# Altium schematic sheet main.SchDoc
size A4
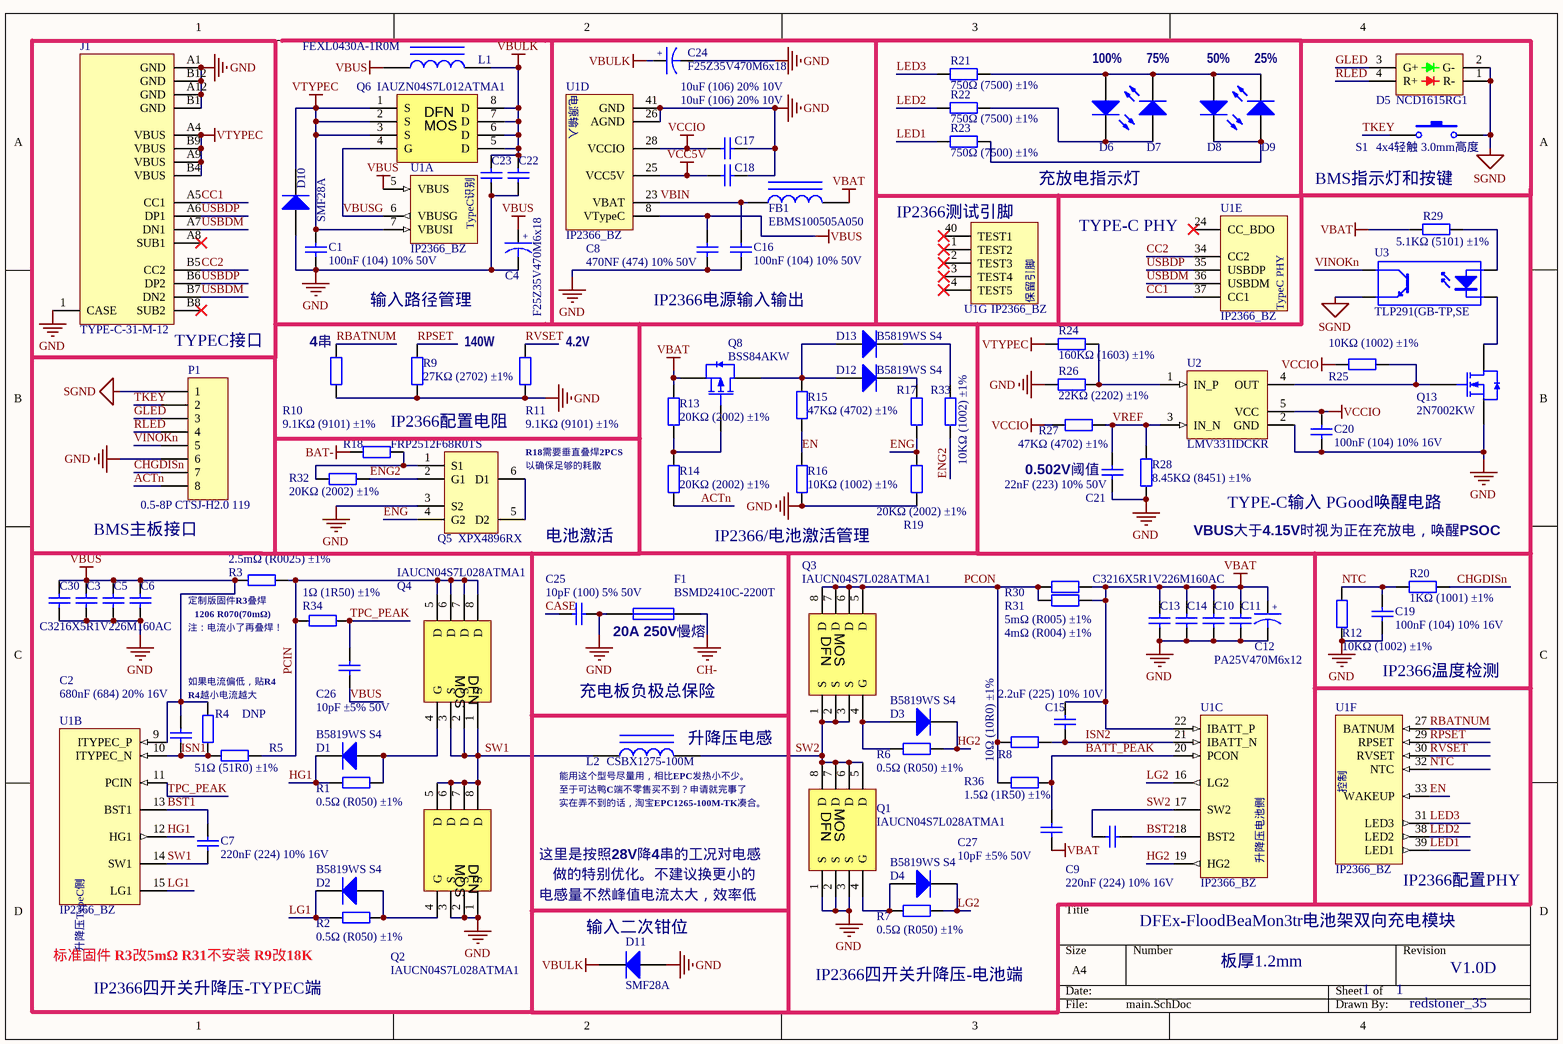
[diagram p0: main.SchDoc]

## Parts
C1  100nF (104) 10% 50V  [0402_C]
C2  680nF (684) 20% 16V  [0402_C]
C3  C3216X5R1V226M160AC  [1206C]
C4  F25Z35V470M6x18  [ElecCap_Hori]
C5  C3216X5R1V226M160AC  [1206C]  (value not drawn)
C6  C3216X5R1V226M160AC  [1206C]  (value not drawn)
C7  220nF (224) 10% 16V  [0402_C]
C8  470NF (474) 10% 50V  [0402_C]
C9  220nF (224) 10% 16V  [0402_C]
C10  C3216X5R1V226M160AC  [1206C]  (value not drawn)
C11  C3216X5R1V226M160AC  [1206C]
C12  PA25V470M6x12  [ElecCap_Hori]
C13  C3216X5R1V226M160AC  [1206C]  (value not drawn)
C14  C3216X5R1V226M160AC  [1206C]  (value not drawn)
C15  2.2uF (225) 10% 10V  [0402_C]
C16  100nF (104) 10% 50V  [0402_C]
C17  10uF (106) 20% 10V  [0402_C]
C18  10uF (106) 20% 10V  [0402_C]
C19  100nF (104) 10% 16V  [0402_C]
C20  100nF (104) 10% 16V  [0402_C]
C21  22nF (223) 10% 50V  [0402_C]
C22  C3216X5R1V226M160AC  [1206C]  (value not drawn)
C23  C3216X5R1V226M160AC  [1206C]  (value not drawn)
C24  F25Z35V470M6x18  [ElecCap_Hori]
C25  10pF (100) 5% 50V  [0402_C]
C26  10pF ±5% 50V  [0402_C]
C27  10pF ±5% 50V  [0402_C]
C30  C3216X5R1V226M160AC  [1206C]  (value not drawn)
D1  B5819WS S4  [SOD-323]
D2  B5819WS S4  [SOD-323]
D3  B5819WS S4  [SOD-323]
D4  B5819WS S4  [SOD-323]
D5  NCD1615RG1  [LED-SMD_4P-L1.6-W1.5-TL-1]
D6  蓝灯 0603  [0603_LED_S1]  (value not drawn)
D7  蓝灯 0603  [0603_LED_S1]  (value not drawn)
D8  蓝灯 0603  [0603_LED_S1]  (value not drawn)
D9  蓝灯 0603  [0603_LED_S1]  (value not drawn)
D10  SMF28A  [SOD-123]
D11  SMF28A  [SOD-123]
D12  B5819WS S4  [SOD-323]
D13  B5819WS S4  [SOD-323]
F1  BSMD2410C-2200T  [Fuse6126]
FB1  EBMS100505A050  [0402_L]
J1  TYPE-C-31-M-12  [USB-C-SMD_KH-TYPE-C-16P]
L1  FEXL0430A-1R0M  [XAL4020-xxxME]
L2  CSBX1275-100M  [CSBX1275]
P1  0.5-8P CTSJ-H2.0 119  [FPC0.5 2H-WS-8P]
Q1  IAUCN04S7L028ATMA1  [SON/DFN5x6(MOS)]
Q2  IAUCN04S7L028ATMA1  [SON/DFN5x6(MOS)]
Q3  IAUCN04S7L028ATMA1  [SON/DFN5x6(MOS)]
Q4  IAUCN04S7L028ATMA1  [SON/DFN5x6(MOS)]
Q5  XPX4896RX  [EDFN3x3]
Q6  IAUZN04S7L012ATMA1  [DFN-8_L3.0-W3.0-P0.65-BL]
Q8  BSS84AKW  [SC70-3]
Q13  2N7002KW  [SC70-3]
R1  0.5Ω (R050) ±1%  [0603_R]
R2  0.5Ω (R050) ±1%  [0603_R]
R3  2.5mΩ (R0025) ±1%  [1206_R]
R4  DNP  [0402_R]
R5  51Ω (51R0) ±1%  [0402_R]
R6  0.5Ω (R050) ±1%  [0603_R]
R7  0.5Ω (R050) ±1%  [0603_R]
R8  10Ω (10R0) ±1%  [0402_R]
R9  27KΩ (2702) ±1%  [0402_R]
R10  9.1KΩ (9101) ±1%  [0402_R]
R11  9.1KΩ (9101) ±1%  [0402_R]
R12  10KΩ (1002) ±1%  [0402_R]
R13  20KΩ (2002) ±1%  [0402_R]
R14  20KΩ (2002) ±1%  [0402_R]
R15  47KΩ (4702) ±1%  [0402_R]
R16  10KΩ (1002) ±1%  [0402_R]
R17  10KΩ (1002) ±1%  [0402_R]  (value not drawn)
R18  FRP2512F68R0TS  [2512]
R19  20KΩ (2002) ±1%  [0402_R]
R20  1KΩ (1001) ±1%  [0402_R]
R21  750Ω (7500) ±1%  [0402_R]
R22  750Ω (7500) ±1%  [0402_R]
R23  750Ω (7500) ±1%  [0402_R]
R24  160KΩ (1603) ±1%  [0402_R]
R25  10KΩ (1002) ±1%  [0402_R]
R26  22KΩ (2202) ±1%  [0402_R]
R27  47KΩ (4702) ±1%  [0402_R]
R28  8.45KΩ (8451) ±1%  [0402_R]
R29  5.1KΩ (5101) ±1%  [0603_R]
R30  5mΩ (R005) ±1%  [1206_R]
R31  4mΩ (R004) ±1%  [1206_R]
R32  20KΩ (2002) ±1%  [0402_R]
R33  10KΩ (1002) ±1%  [0402_R]
R34  1Ω (1R50) ±1%  [0402_R]
R36  1.5Ω (1R50) ±1%  [0402_R]
S1  4x4轻触 3.0mm高度  [SW-SMD_4P-L5.2-W5.2-P3.70-LS6.4]
U1  IP2366_BZ  [QFN40-IP2366]  (parts A,B,C,D,E,F,G of 7)
U2  LMV331IDCKR  [SC70-5]
U3  TLP291(GB-TP,SE  [SOP127P700X210-4M]

## Blocks framed on the sheet
TYPEC接口: J1

## Nets
BAT-: R18.1
CH-: F1.2
GND: C1.1 C3.1 C4.2 C5.1 C6.1 C8.1 C10.1 C11.1 C12.2 C13.1 C14.1 C16.1 C17.2 C18.2 C19.1 C20.1 C21.1 C22.1 C23.1 C24.2 C25.2 C30.1 D10.1(A) D11.1(A) F1.1 J1.1(CASE) J1.A1(GND) J1.A12(GND) J1.B1(GND) J1.B12(GND) P1.6 Q1.1(S) Q1.2(S) Q1.3(S) Q2.1(S) Q2.2(S) Q2.3(S) Q5.3(S2) Q13.2(S) R9.1 R10.1 R11.1 R12.1 R16.1 R19.1 R26.1 R28.1 U1.26(AGND) U1.41(GND) U2.2(GND)
SGND: D5.1(R-) D5.2(G-) P1.1 S1.2 U3.3(E)
VBAT: C10.2 C11.2 C12.1 C13.2 C14.2 C15.2 C27.1 FB1.2 Q8.2(S) R13.2 R29.1 R30.2 R31.2 U1.22(IBATT_P)
VBULK: C22.2 C23.2 C24.1 D11.2(K) L1.2 Q6.5(D) Q6.6(D) Q6.7(D) Q6.8(D)
VBUS: C2.2 C3.2 C4.1 C5.2 C6.2 C8.2 C26.1 C30.2 L1.1 R3.1 R4.2 U1.5(VBUS) U1.8(VTypeC) U1.9(ITYPEC_P)
VCC5V: C18.1 U1.25(VCC5V)
VCCIO: C17.1 C20.2 R25.2 R27.1 U1.28(VCCIO) U2.5(VCC)
VTYPEC: C1.2 D10.2(K) J1.A4(VBUS) J1.A9(VBUS) J1.B4(VBUS) J1.B9(VBUS) Q6.1(S) Q6.2(S) Q6.3(S) R24.1 U1.7(VBUSI)
ACTn: P1.8 R14.1
BATT_PEAK: C27.2 R36.1 U1.20(PCON)
BST1: C7.2 U1.13(BST1)
BST2: C9.2 U1.18(BST2)
CASE: C25.1
CC1: J1.A5(CC1) U1.37(CC1)
CC2: J1.B5(CC2) U1.34(CC2)
CHGDISn: P1.7 R20.2
EN: R15.1 R16.2 U1.33(WAKEUP)
ENG: Q5.4(G2) R17.1 R19.2
ENG2: Q5.2(G1) R32.2 R33.1
GLED: D5.3(G+) P1.3
HG1: D1.2(K) R1.1 U1.12(HG1)
HG2: D3.2(K) R6.2 U1.19(HG2)
ISN1: C2.1 R4.1 R5.1 U1.10(ITYPEC_N)
ISN2: C15.1 R8.2 U1.21(IBATT_N)
LED1: R23.1 U1.39(LED1)
LED2: R22.1 U1.38(LED2)
LED3: R21.1 U1.31(LED3)
LG1: D2.2(K) R2.1 U1.15(LG1)
LG2: D4.2(K) R7.2 U1.16(LG2)
NTC: C19.2 R12.2 R20.1 U1.32(NTC)
PCIN: Q4.5(D) Q4.6(D) Q4.7(D) Q4.8(D) R3.2 R5.2 R34.2
PCON: Q3.5(D) Q3.6(D) Q3.7(D) Q3.8(D) R8.1 R30.1 R31.1 R36.2
RBATNUM: R10.2 U1.27(BATNUM)
RLED: D5.4(R+) P1.4
RPSET: R9.2 U1.29(RPSET)
RVSET: R11.2 U1.30(RVSET)
SW1: C7.1 L2.1 Q2.5(D) Q2.6(D) Q2.7(D) Q2.8(D) Q4.1(S) Q4.2(S) Q4.3(S) U1.14(SW1)
SW2: C9.1 L2.2 Q1.5(D) Q1.6(D) Q1.7(D) Q1.8(D) Q3.1(S) Q3.2(S) Q3.3(S) U1.17(SW2)
TKEY: P1.2 S1.1
TPC_PEAK: C26.2 R34.1 U1.11(PCIN)
USBDM: J1.A7(DN1) J1.B7(DN2) U1.36(USBDM)
USBDP: J1.A6(DP1) J1.B6(DP2) U1.35(USBDP)
VBIN: C16.2 FB1.1 U1.23(VBAT)
VBUSG: Q6.4(G) U1.6(VBUSG)
VINOKn: P1.5 U3.4(C)
VREF: C21.2 R27.2 R28.2 U2.3(IN_N)
NetD1_1: D1.1(A) Q4.4(G) R1.2
NetD2_1: D2.1(A) Q2.4(G) R2.2
NetD3_1: D3.1(A) Q3.4(G) R6.1
NetD4_1: D4.1(A) Q1.4(G) R7.1
NetD6_A: D6.A D7.K D8.A D9.K R21.2
NetD6_K: D6.K D7.A R22.2
NetD8_K: D8.K D9.A R23.2
NetD12_1: D12.1(A) D13.1(A) Q8.3(D) R15.2
NetD12_2: D12.2(K) R17.2
NetD13_2: D13.2(K) R33.2
NetQ5_1: Q5.1(S1) R18.2 R32.1
NetQ5_5: Q5.5(D2) Q5.6(D1)
NetQ8_1: Q8.1(G) R13.1 R14.2
NetQ13_1: Q13.1(G) R25.1 U2.4(OUT)
NetQ13_3: Q13.3(D) U3.2(K)
NetR24_2: R24.2 R26.2 U2.1(IN_P)
NetR29_2: R29.2 U3.1(A)

Not connected (* = marked no-connect by the designer): J1 A8(SUB1)* B8(SUB2)*; U1 1(TEST2)* 2(TEST3)* 3(TEST4)* 4(TEST5)* 24(CC_BDO)* 40(TEST1)*

## Notes on the sheet
- 100%
- 75%
- 50%
- 25%
- 充放电指示灯
- BMS指示灯和按键
- (near U1) IP2366测试引脚
- TYPE-C PHY
- 输入路径管理
- IP2366电源输入输出
- (near R10) 4串
- 140W
- (near R11) 4.2V
- IP2366配置电阻
- (near Q5) R18需要垂直叠焊2PCS
- (near Q5) 以确保足够的耗散
- 0.502V阈值
- TYPE-C输入 PGood唤醒电路
- BMS主板接口
- 电池激活
- IP2366/电池激活管理
- VBUS大于4.15V时视为正在充放电，唤醒PSOC
- (near R3) 定制版固件R3叠焊
- 注：电流小了再叠焊！
- 1206 R070(70mΩ)
- (near F1) 20A 250V慢熔
- 如果电流偏低，贴R4
- (near R4) R4越小电流越大
- 充电板负极总保险
- IP2366温度检测
- (near L2) 能用这个型号尽量用，相比EPC发热小不少。
- (near L2) 至于可达鸭C端不零售买不到？申请就完事了
- (near L2) 升降压电感
- 这里是按照28V降4串的工况对电感
- (near L2) 实在弄不到的话，淘宝EPC1265-100M-TK凑合。
- 电感量不然峰值电流太大，效率低
- 做的特别优化。不建议换更小的
- (near D11) 输入二次钳位
- (near U1) DFEx-FloodBeaMon3tr电池架双向充电模块
- (near U1) IP2366配置PHY
- 标准固件 R3改5mΩ R31不安装 R9改18K
- IP2366四开关升降压-TYPEC端
- IP2366四开关升降压-电池端
- 板厚1.2mm
- 1
- V1.0D
- redstoner_35
- (in symbol CAP2) +
- (in symbol IP2366_BZ, part A) TypeC识别
- (in symbol IP2366_BZ, part B) 升降压TypeC侧
- (in symbol IP2366_BZ, part C) 升降压电池侧
- (in symbol IP2366_BZ, part D) 电源输入
- (in symbol IP2366_BZ, part E) TypeC PHY
- (in symbol IP2366_BZ, part F) 控制
- (in symbol IP2366_BZ, part G) 保留引脚
- (in symbol SON/DFN5x6 MOS) MOS; DFN

## Library data of the parts
C1 C16 C19 C20 = 0402 100nF (104) 10% 16V: 贴片电容; ComponentLink1Description: 供应商链接; ComponentLink1URL: http://www.szlcsc.com/product/details_1877.html; Package: 0402; Supplier: LC; SuppliersPartNumber: C1525
C2 = 0402 470nF (474) 10% 10V: 贴片电容; ComponentLink1Description: 供应商链接; ComponentLink1URL: http://www.szlcsc.com/product/details_48344.html; Package: 0402; Supplier: LC; SuppliersPartNumber: C47339
C3 C5 C6 C10 C11 C13 C14 C22 C23 C30 = Cap: 1206尺寸TDK MLCC 35V 22uF; Published: 8-Jun-2000; LatestRevisionDate: 17-Jul-2002; LatestRevisionNote: Re-released for DXP Platform.; PackageReference: RAD-0.3; Publisher: Altium Limited; PackageDescription: Radial Cap, Thru-Hole; 2 Leads; 0.3 in Pin Spacing; Value: 22uF
C4 C24 = CAP2: 直插艾华固态电容，耐压35V容量470uF，尺寸D6.3x18
C7 C9 = 0402 220nF (224) 10% 16V: 贴片电容; ComponentLink1Description: 供应商链接; ComponentLink1URL: http://www.szlcsc.com/product/details_17456.html; Package: 0402; Supplier: LC; SuppliersPartNumber: C16772
C8 C15 = 0402 1.0uF (105) 10% 25V: 贴片电容; ComponentLink1Description: 供应商链接; ComponentLink1URL: http://www.szlcsc.com/product/details_53938.html; Package: 0402; Supplier: LC; SuppliersPartNumber: C52923
C12 = CAP2: 直插固态电容，耐压25V容量470uF，尺寸D6.3x12
C17 C18 = 0402 10uF (106) 20% 6.3V: 贴片电容; ComponentLink1Description: 供应商链接; ComponentLink1URL: http://www.szlcsc.com/product/details_16204.html; Package: 0402; Supplier: LC; SuppliersPartNumber: C15525
C21 = 0402 22nF (223) 10% 50V: 贴片电容; ComponentLink1Description: 供应商链接; ComponentLink1URL: http://www.szlcsc.com/product/details_1884.html; Package: 0402; Supplier: LC; SuppliersPartNumber: C1532
C25 = 0402 10pF (100) 5% 50V: 贴片电容; ComponentLink1Description: 供应商链接; ComponentLink1URL: http://www.szlcsc.com/product/details_33914.html; Package: 0402; Supplier: LC; SuppliersPartNumber: C32949
C26 C27 = 0402 1nF (102) 10% 50V: 贴片电容; ComponentLink1Description: 供应商链接; ComponentLink1URL: http://www.szlcsc.com/product/details_1875.html; Package: 0402; Supplier: LC; SuppliersPartNumber: C1523
D1-D4 D12 D13 = SOD-323 1N4148WS T4: 二极管; ComponentLink1Description: 供应商链接; ComponentLink1URL: http://www.szlcsc.com/product/details_2485.html; Package: SOD-323; Supplier: LC; SuppliersPartNumber: C2128
D5 = 0606DualColor LED: 国星光电 0606(1615) 尺寸 双色LED 红色/翠绿
D6-D9 = 0603 蓝灯: 发光二极管; ComponentLink1Description: 供应商链接; ComponentLink1URL: http://www.szlcsc.com/product/details_73150.html; Package: 0603; Supplier: LC; SuppliersPartNumber: C72041
D10 D11 = SOD-123 B5819W  SL: SOD123封装单向TVS二极管 28V反向截止电压 峰值脉冲电流4.4A@10/1000us; ComponentLink1Description: 供应商链接; ComponentLink1URL: http://www.szlcsc.com/product/details_9093.html; Package: SOD-123; Supplier: LC; SuppliersPartNumber: C8598
F1 = Fuse 1: 2410尺寸 20A 250V 一次性 慢速熔断陶瓷保险丝; Published: 8-Jun-2000; LatestRevisionDate: 17-Jul-2002; LatestRevisionNote: Re-released for DXP Platform.; PackageReference: PIN-W2/E2.8; Publisher: Altium Limited; PackageDescription: Thru-Hole; 2 Leads
FB1 = 0402 12nH  5%: 贴片磁珠 200mA 5R±25% 100MHz; ComponentLink1Description: 供应商链接; ComponentLink1URL: http://www.szlcsc.com/product/details_25303.html; Package: 0402; Supplier: LC; SuppliersPartNumber: C24563
J1 = KH-TYPEC-16P: 16Pin TypeC卧式贴片座子，韩国韩荣
L1 = Inductor Iron: 长江微电一体成型电感，1.0uH±20% 14.6mΩ DCR 9.8A饱和电流; Value: 1.5uH; Published: 24-Mar-1999; LatestRevisionDate: 17-Jul-2002; LatestRevisionNote: Re-released for DXP Platform.; PackageReference: AXIAL-0.9; Publisher: Altium Limited; PackageDescription: Axial Device, Thru-Hole; 2 Leads; 0.9 in Pin Spacing
L2 = Inductor Iron: 科达嘉电子扁线一体成型电感，13.8*12.8*7.3mm，10uH 21.0A 8.77mΩ; Value: 10uH; Published: 24-Mar-1999; LatestRevisionDate: 17-Jul-2002; LatestRevisionNote: Re-released for DXP Platform.; PackageReference: AXIAL-0.9; Publisher: Altium Limited; PackageDescription: Axial Device, Thru-Hole; 2 Leads; 0.9 in Pin Spacing; RelatedWebLink: https://www.codaca.com.cn/Private/Pdf/CSBX1275.pdf
P1 = CON 8: FFC/FPC连接器 间距：0.5mm，P数：8P，卧贴，抽屉式上接，厚度H2.0mm; LatestRevisionDate: 17-Jul-2002; LatestRevisionNote: Re-released for DXP Platform.; Publisher: Altium Limited
Q1-Q4 = SON/DFN5x6 MOS: 40V, N-Ch, 2.80mΩ max, Automotive MOSFET, SSO8(5x6), OptiMOS™ 7
Q5 = XPX10H03RX: 双N沟道MOSFET, DFN3x3 40V 45A 7.2mΩ
Q6 = SON/DFN5x6 MOS: OptiMOS 7 40V Logic Level Power MOSFET, 1.55mΩ @ 4.5V LL,S3O8(PDFN3333) Package
Q8 = SI2301CDS-T1-GE3: 单P沟道小信号MOSFET(场效应管); ComponentLink1Description: 供应商链接; ComponentLink1URL: http://www.szlcsc.com/product/details_11030.html; Package: SOT-23(SOT-23-3); Supplier: LC; SuppliersPartNumber: C10487
Q13 = 2N7002 7002: 单N沟道MOSFET(场效应管); ComponentLink1Description: 供应商链接; ComponentLink1URL: http://www.szlcsc.com/product/details_9040.html; Package: SOT-323; Supplier: LC; SuppliersPartNumber: C???????
R1 R2 R6 R7 = 0603 0Ω (0R0) 1%: 贴片电阻; ComponentLink1Description: 供应商链接; ComponentLink1URL: http://www.szlcsc.com/product/details_21903.html; Package: 0603; Supplier: LC; SuppliersPartNumber: C21189
R3 = 1206 0Ω (0R0) 1%: 1206贴片合金检流电阻 2.5mΩ; ComponentLink1Description: 供应商链接; ComponentLink1URL: http://www.szlcsc.com/product/details_18576.html; Package: 1206; Supplier: LC; SuppliersPartNumber: C17888
R4 = 0402 3.3KΩ (3301) 1%: 贴片电阻(暂时空置); ComponentLink1Description: 供应商链接; ComponentLink1URL: http://www.szlcsc.com/product/details_26633.html; Package: 0402; Supplier: LC; SuppliersPartNumber: C25890
R5 R34 R36 = 0402 51Ω (51R0) 1%: 贴片电阻; ComponentLink1Description: 供应商链接; ComponentLink1URL: http://www.szlcsc.com/product/details_25868.html; Package: 0402; Supplier: LC; SuppliersPartNumber: C25125
R8 = 0402 10Ω (10R0) 1%: 贴片电阻; ComponentLink1Description: 供应商链接; ComponentLink1URL: http://www.szlcsc.com/product/details_25820.html; Package: 0402; Supplier: LC; SuppliersPartNumber: C25077
R9 = 0402 18KΩ (1802) 1%: 贴片电阻; ComponentLink1Description: 供应商链接; ComponentLink1URL: http://www.szlcsc.com/product/details_26505.html; Package: 0402; Supplier: LC; SuppliersPartNumber: C25762
R10-R12 R16 R17 R25 R28 R33 = 0402 10KΩ (1002) 1%: 贴片电阻; ComponentLink1Description: 供应商链接; ComponentLink1URL: http://www.szlcsc.com/product/details_26487.html; Package: 0402; Supplier: LC; SuppliersPartNumber: C25744
R13 R14 R19 R32 = 0402 20KΩ (2002) 1%: 贴片电阻; ComponentLink1Description: 供应商链接; ComponentLink1URL: http://www.szlcsc.com/product/details_26508.html; Package: 0402; Supplier: LC; SuppliersPartNumber: C25765
R15 R27 = 0402 47KΩ (4702) 1%: 贴片电阻; ComponentLink1Description: 供应商链接; ComponentLink1URL: http://www.szlcsc.com/product/details_26535.html; Package: 0402; Supplier: LC; SuppliersPartNumber: C25792
R18 = Res: 高功率2512封装厚膜电阻 68Ω ±1% 2W; Published: 8-Jun-2000; LatestRevisionDate: 17-Jul-2002; LatestRevisionNote: Re-released for DXP Platform.; PackageReference: AXIAL-0.4; Publisher: Altium Limited; PackageDescription: Axial Device, Thru-Hole; 2 Leads; 0.4 in Pin Spacing; Value: 68Ω
R20 = 0402 1KΩ (1001) 1%: 贴片电阻; ComponentLink1Description: 供应商链接; ComponentLink1URL: http://www.szlcsc.com/product/details_12256.html; Package: 0402; Supplier: LC; SuppliersPartNumber: C11702
R21-R23 = 0402 200Ω (2000) 1%: 贴片电阻; ComponentLink1Description: 供应商链接; ComponentLink1URL: http://www.szlcsc.com/product/details_25830.html; Package: 0402; Supplier: LC; SuppliersPartNumber: C25087
R24 = 0402 100KΩ (1003) 1%: 贴片电阻; ComponentLink1Description: 供应商链接; ComponentLink1URL: http://www.szlcsc.com/product/details_26484.html; Package: 0402; Supplier: LC; SuppliersPartNumber: C25741
R26 = 0402 22KΩ (2202) 1%: 贴片电阻; ComponentLink1Description: 供应商链接; ComponentLink1URL: http://www.szlcsc.com/product/details_26511.html; Package: 0402; Supplier: LC; SuppliersPartNumber: C25768
R29 = 0603 4.7KΩ (4701) 1%: 贴片电阻; ComponentLink1Description: 供应商链接; ComponentLink1URL: http://www.szlcsc.com/product/details_23889.html; Package: 0603; Supplier: LC; SuppliersPartNumber: C23162
R30 R31 = 1206 0Ω (0R0) 1%: 贴片合金检流电阻; ComponentLink1Description: 供应商链接; ComponentLink1URL: http://www.szlcsc.com/product/details_18576.html; Package: 1206; Supplier: LC; SuppliersPartNumber: C17888
S1 = SW-PB: 4x4mm锅仔片结构金属轻触开关 H3.0mm; pin to pad: 2>3; Published: 24-Mar-1999; LatestRevisionDate: 17-Jul-2002; LatestRevisionNote: Re-released for DXP Platform.; PackageReference: SPST-2; Publisher: Altium Limited; PackageDescription: Switch; 2 Leads
U1 = IP2366_BZ: 支持多种快充协议，最高140W功率的充放电管理SoC
U2 = LMV331IDCKR: 单路通用低电压比较器，2.7-5.5V，SC70-5封装
U3 = Optoisolator1: DC输入 光电耦合隔离器 隔离电压(rms):3750V SOP-4封装; Published: 24-Mar-1999; LatestRevisionDate: 04-Mar-2005; LatestRevisionNote: Sch pins 3 & 4 Swapped.; DatasheetVersion: Nov-2003; PackageReference: DIP-4; Publisher: Altium Limited